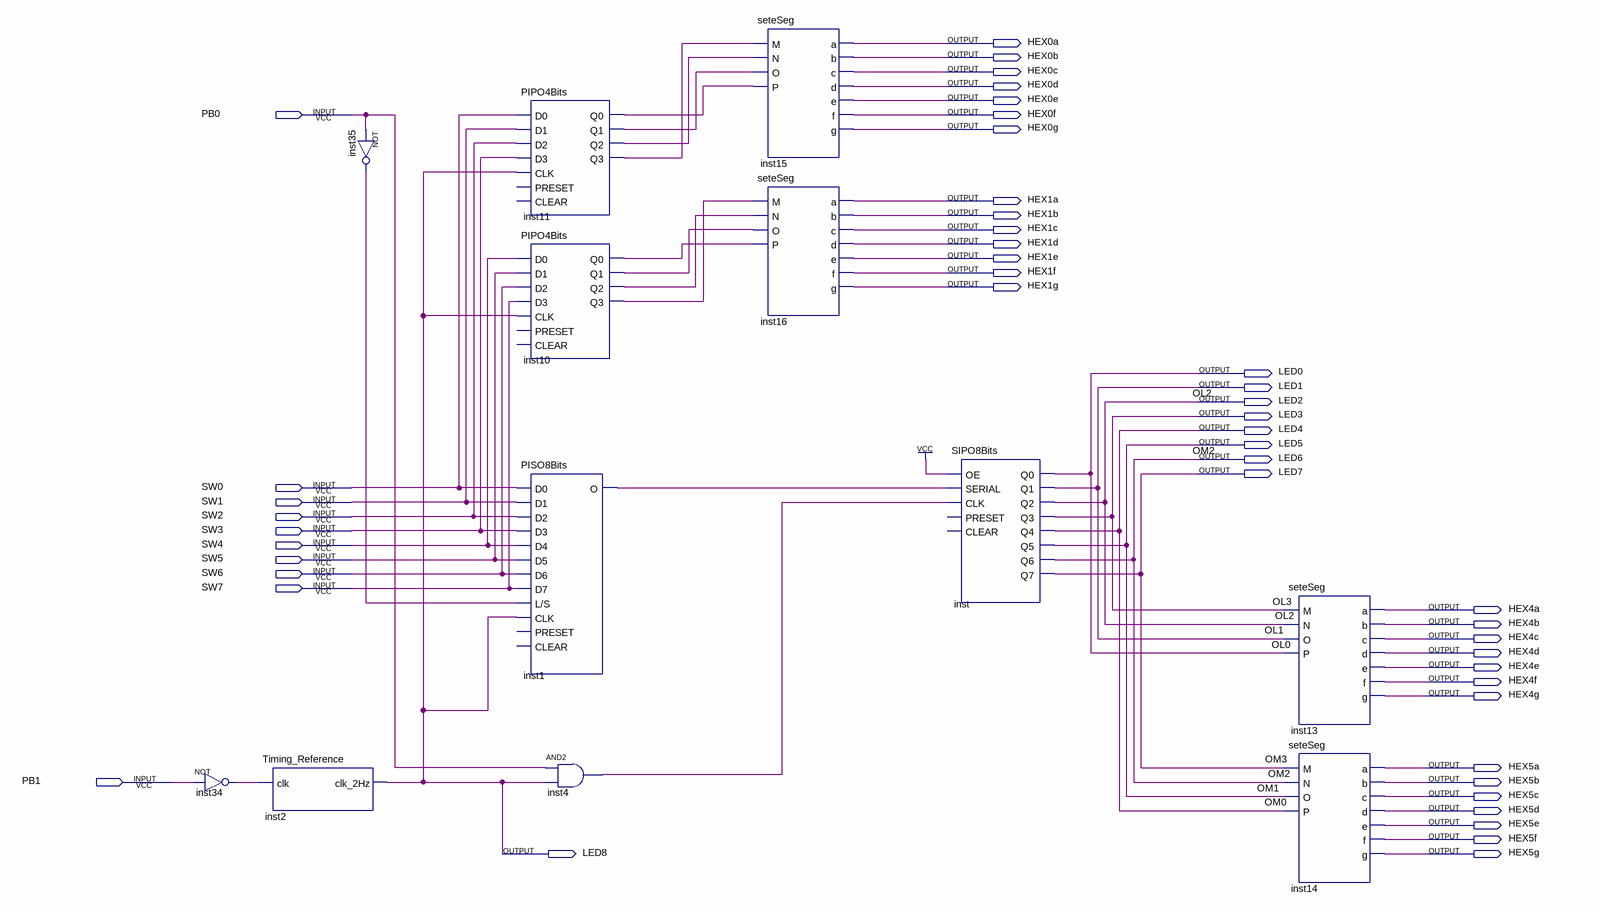
[diagram p0: schematic sheet]
// Quartus schematic lab3.bdf as structural Verilog: 12 symbols, 47 pins
module lab3 (
  input  PB0,
  input  SW0,
  input  SW1,
  input  SW2,
  input  SW3,
  input  SW4,
  input  SW5,
  input  SW6,
  input  SW7,
  input  PB1,
  output HEX0a,
  output HEX0b,
  output HEX0c,
  output HEX0d,
  output HEX0e,
  output HEX0f,
  output HEX0g,
  output HEX1a,
  output HEX1b,
  output HEX1c,
  output HEX1d,
  output HEX1e,
  output HEX1f,
  output HEX1g,
  output LED0,
  output LED1,
  output LED2,
  output LED3,
  output LED4,
  output LED5,
  output LED6,
  output LED7,
  output HEX4a,
  output HEX4b,
  output HEX4c,
  output HEX4d,
  output HEX4e,
  output HEX4f,
  output HEX4g,
  output HEX5a,
  output HEX5b,
  output HEX5c,
  output HEX5d,
  output HEX5e,
  output HEX5f,
  output LED8,
  output HEX5g
);

  wire inst1_o, inst4_out, inst10_q0, inst10_q1, inst10_q2, inst10_q3, inst11_q0, inst11_q1, inst11_q2,
       inst11_q3, inst34_out, inst35_out;

  not inst34 (inst34_out, PB1);
  Timing_Reference inst2 (.clk(inst34_out), .clk_2Hz(LED8));
  not inst35 (inst35_out, PB0);
  PIPO4Bits inst11 (
    .D0(SW0), .D1(SW1), .D2(SW2), .D3(SW3), .CLK(LED8), .Q0(inst11_q0), .Q1(inst11_q1), .Q2(inst11_q2),
    .Q3(inst11_q3));  // open: PRESET, CLEAR
  PIPO4Bits inst10 (
    .D0(SW4), .D1(SW5), .D2(SW6), .D3(SW7), .CLK(LED8), .Q0(inst10_q0), .Q1(inst10_q1), .Q2(inst10_q2),
    .Q3(inst10_q3));  // open: PRESET, CLEAR
  PISO8Bits inst1 (
    .D0(SW0), .D1(SW1), .D2(SW2), .D3(SW3), .D4(SW4), .D5(SW5), .D6(SW6), .D7(SW7), .\L/S (inst35_out),
    .CLK(LED8), .O(inst1_o));  // open: PRESET, CLEAR
  and inst4 (inst4_out, PB0, LED8);
  seteSeg inst15 (
    .M(inst11_q3), .N(inst11_q2), .O(inst11_q1), .P(inst11_q0), .a(HEX0a), .b(HEX0b), .c(HEX0c), .d(HEX0d),
    .e(HEX0e), .f(HEX0f), .g(HEX0g));
  seteSeg inst16 (
    .M(inst10_q3), .N(inst10_q2), .O(inst10_q1), .P(inst10_q0), .a(HEX1a), .b(HEX1b), .c(HEX1c), .d(HEX1d),
    .e(HEX1e), .f(HEX1f), .g(HEX1g));
  SIPO8Bits inst (
    .OE(1'b1), .SERIAL(inst1_o), .CLK(inst4_out), .Q0(LED0), .Q1(LED1), .Q2(LED2), .Q3(LED3), .Q4(LED4),
    .Q5(LED5), .Q6(LED6), .Q7(LED7));  // open: PRESET, CLEAR
  seteSeg inst13 (
    .M(LED3), .N(LED2), .O(LED1), .P(LED0), .a(HEX4a), .b(HEX4b), .c(HEX4c), .d(HEX4d), .e(HEX4e), .f(HEX4f),
    .g(HEX4g));
  seteSeg inst14 (
    .M(LED7), .N(LED6), .O(LED5), .P(LED4), .a(HEX5a), .b(HEX5b), .c(HEX5c), .d(HEX5d), .e(HEX5e), .f(HEX5f),
    .g(HEX5g));

  // Other names for the same wires on the sheet: OL0 = LED0; OL1 = LED1; OL3 = LED3; OM0 = LED4; OM1 = LED5;
  //   OM3 = LED7; OL2 = LED2; OM2 = LED6
endmodule
